# Altium schematic sheet humidity.SchDoc: Humidity Sensors
size A4; CheckedBy: rrodrigu; Author: Satxo; CompanyName: Satxo; Revision: 0v1; SheetNumber: 4; SheetTotal: 8; ProjectName: Basestation
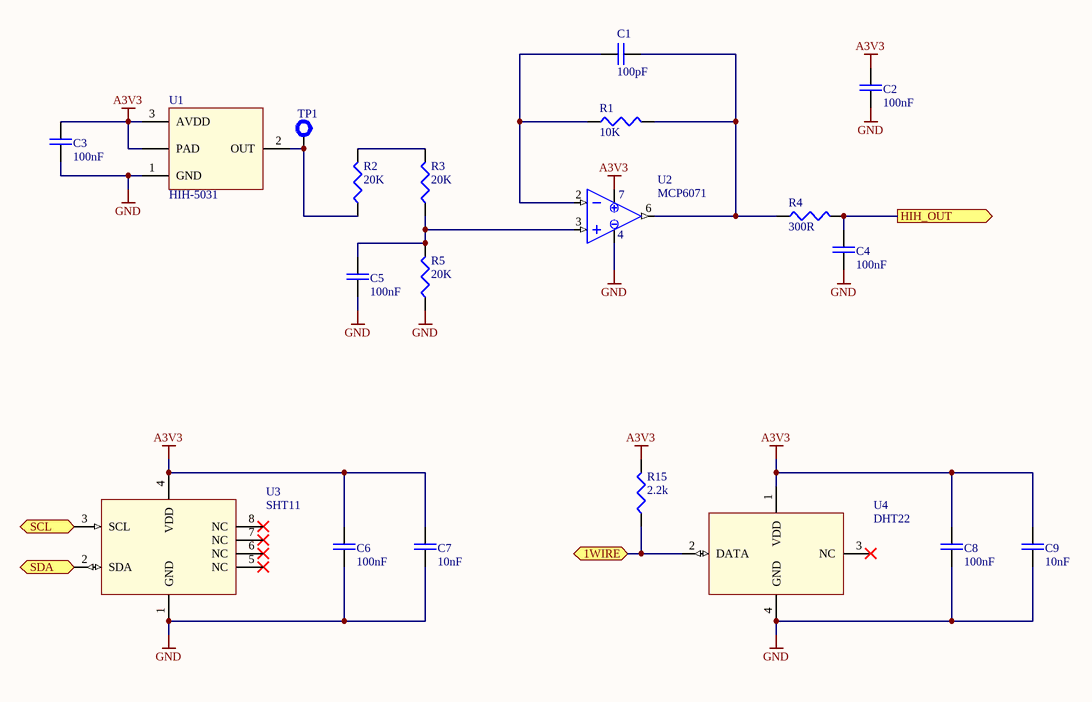
[diagram p0: humidity.SchDoc]

## Parts
C1  100pF  [0603]
C2  100nF  [0603]
C3  100nF  [0603]
C4  100nF  [0603]
C5  100nF  [0603]
C6  100nF  [0603]
C7  10nF  [0603]
C8  100nF  [0603]
C9  10nF  [0603]
R1  10K  [0603]
R2  20K  [0603]
R3  20K  [0603]
R4  300R  [0603]
R5  20K  [0603]
R15  2.2k  [0603]
TP1  Test Point  [TERMINAL]  (value not drawn)  (no BOM)
U1  HIH-5031  [HIH]
U2  MCP6071  [SOIC-8]
U3  SHT11  [SHT]
U4  DHT22  [DHT22]

## Ports
1WIRE (bidir), HIH_OUT (out), SCL (in), SDA (bidir)

## Nets
A3V3: C2.2 C3.2 C6.2 C7.2 C8.2 C9.2 R15.2 U1.3(AVDD) U1.PAD U2.7(VDD) U3.4(VDD) U4.1(VDD)
GND: C2.1 C3.1 C4.1 C5.1 C6.1 C7.1 C8.1 C9.1 R5.1 U1.1(GND) U2.4(VSS) U3.1(GND) U4.4(GND)
1WIRE: R15.1 U4.2(DATA) ; port 1WIRE
HIH_OUT: C4.2 R4.2 ; port HIH_OUT
SCL: U3.3(SCL) ; port SCL
SDA: U3.2(SDA) ; port SDA
NetC1_1: C1.1 R1.1 U2.2(INN)
NetC1_2: C1.2 R1.2 R4.1 U2.6(VOUT)
NetC5_2: C5.2 R3.1 R5.2 U2.3(INP)
NetR2_1: R2.1 TP1.1(TP) U1.2(OUT)
NetR2_2: R2.2 R3.2

Not connected (* = marked no-connect by the designer): U3 5(NC)* 6(NC)* 7(NC)* 8(NC)*; U4 3(NC)*

## Notes on the sheet
- Title
- Size:
- Date:
- A4
- Number:
- Time:
- Revision:
- Sheet
- of
- File:

## Library data of the parts
C1-C9 = CAP: Capacitor; Owner: Nuno Brum; Sub-Type: Ceramic; Assembly: INS; Maximum Voltage: *; Creation Date: 2005-04-28; Status: Valid; Validation date: 2006-05-15; Type: Capacitor
R1-R5 R15 = RES: Resistor; Owner: Nuno Brum; Sub-Type: Generic; Assembly: INS; Validation date: 2006-05-15; Creation Date: 2002-07-17; Status: Valid; Power: *; Type: Resistor
TP1 = TEST-PROBE: Test/Probe Point; Owner: Nuno Brum; Sub-Type: Mechanical; Assembly: PCB; Validation Date: 2006-05-15; Type: PCB; Creation Date: 2005-06-01; Status: Valid
U1 = HIH-5031: Low Voltage Humidity Sensor; Type: IC; Creation Date: 2012-03-05
U2 = MCP6V26: Low-Offset Opamp; Type: IC; Creation Date: 2012-03-15
U3 = SHT11: Digital Humidity and Temperature Sensor; Type: IC; Creation Date: 2012-12-08
U4 = DHT22: Digital Humidity and Temperature Sensor; Type: IC; Creation Date: 2012-12-09